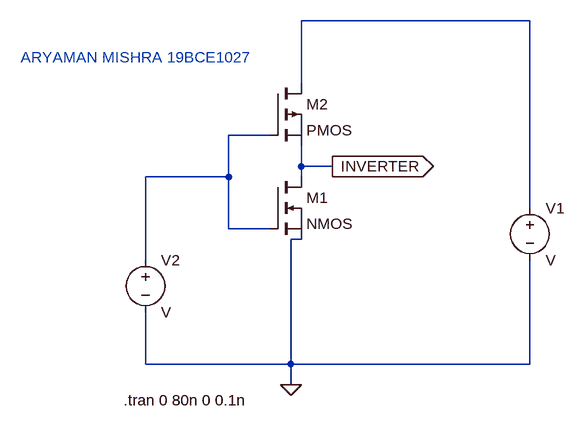
[diagram p0: schematic Draft1.asc]
Draft1.asc, the LTspice schematic file:
Version 4
SHEET 1 880 680
WIRE 560 -160 208 -160
WIRE 208 -64 208 -160
WIRE 160 16 96 16
WIRE 208 64 208 32
WIRE 256 64 208 64
WIRE 96 80 96 16
WIRE 96 80 -32 80
WIRE 208 80 208 64
WIRE 560 128 560 -160
WIRE 96 160 96 80
WIRE 160 160 96 160
WIRE 208 176 192 176
WIRE -32 208 -32 80
WIRE -32 368 -32 288
WIRE 192 368 192 176
WIRE 192 368 -32 368
WIRE 560 368 560 208
WIRE 560 368 192 368
WIRE 192 400 192 368
FLAG 192 400 0
FLAG 256 64 INVERTER
IOPIN 256 64 Out
SYMBOL nmos 160 80 R0
SYMATTR InstName M1
SYMBOL pmos 160 -64 R0
SYMATTR InstName M2
SYMBOL voltage 560 112 R0
SYMATTR InstName V1
SYMBOL voltage -32 192 R0
SYMATTR InstName V2
TEXT -66 424 Left 2 !.tran 0 80n 0 0.1n
TEXT -224 -104 Left 2 ;ARYAMAN MISHRA 19BCE1027

The netlist it stands for:
* Draft1.asc
M1 INVERTER N002 0 0 NMOS
M2 N001 N002 INVERTER INVERTER PMOS
V1 N001 0 V
V2 N002 0 V
.model NMOS NMOS
.model PMOS PMOS
.lib standard.mos
.tran 0 80n 0 0.1n
* ARYAMAN MISHRA 19BCE1027
.backanno
.end